# Altium project DuAn_HMI_F7.PrjPcb
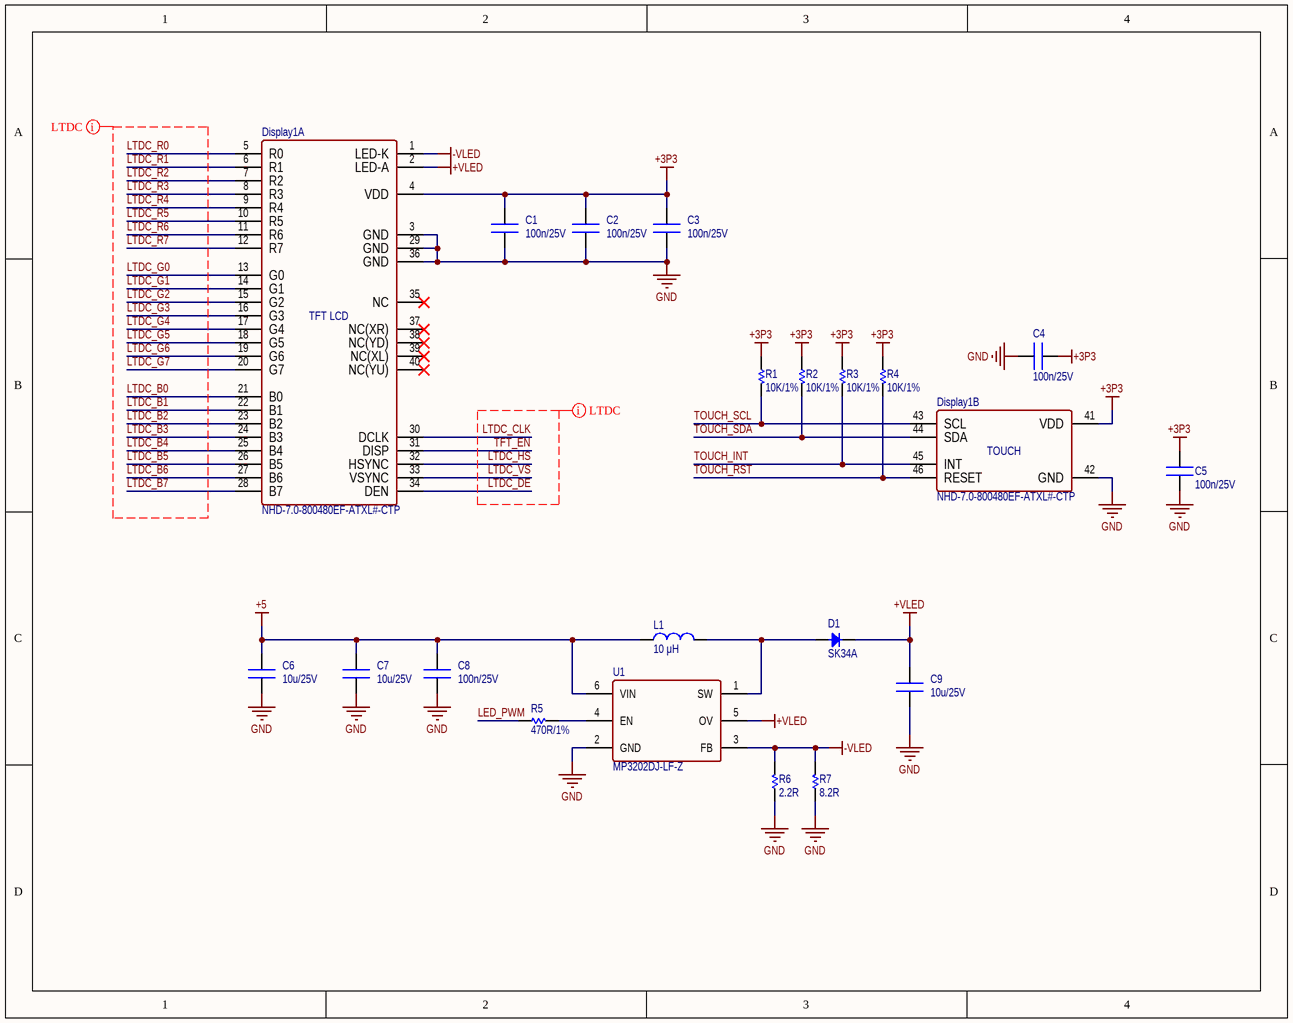
[diagram p0: LCD_TFT.SchDoc]
4 sheets, 65 parts. Net scope: global (net labels, ports and power ports of the same name join across sheets).
Board file: PCB2.PcbDoc
Sheets:
  LCD_TFT.SchDoc
  SDRAM.SchDoc
  MCU.SchDoc
  RS232.SchDoc

## Sheet LCD_TFT.SchDoc
size A; SheetNumber: 1; SheetTotal: 4

### Parts
C1  100n/25V  [CN-SMD-0603]
C2  100n/25V  [CN-SMD-0603]
C3  100n/25V  [CN-SMD-0603]
C4  100n/25V  [CN-SMD-0603]
C5  100n/25V  [CN-SMD-0603]
C6  10u/25V  [CN-SMD-0603]
C7  10u/25V  [CN-SMD-0603]
C8  100n/25V  [CN-SMD-0603]
C9  10u/25V  [CN-SMD-0603]
D1  SK34A  [DIO-SMD-A]
Display1  NHD-7.0-800480EF-ATXL#-CTP  [NHD-7.0-800480EF-ATXL#-CTP]  (parts A,B of 2)
L1  10 μH  [L-SMD-M-5x5]
R1  10K/1%  [RES-SMD-0603]
R2  10K/1%  [RES-SMD-0603]
R3  10K/1%  [RES-SMD-0603]
R4  10K/1%  [RES-SMD-0603]
R5  470R/1%  [RES-SMD-0603]
R6  2.2R  [RES-SMD-0805]
R7  8.2R  [RES-SMD-0805]
U1  MP3202DJ-LF-Z  [SOT23-6]

### Nets
+3P3: C1.2 C2.2 C3.2 C4.2 C5.2 Display1.4(VDD) Display1.41(VDD) R1.1 R2.1 R3.1 R4.1
+5: C6.2 C7.2 C8.2 L1.1 U1.6(VIN)
+VLED: C9.2 D1.2(K) Display1.2(LED-A) U1.5(OV)
-VLED: Display1.1(LED-K) R6.2 R7.2 U1.3(FB)
GND: C1.1 C2.1 C3.1 C4.1 C5.1 C6.1 C7.1 C8.1 C9.1 Display1.3(GND) Display1.29(GND) Display1.36(GND) Display1.42(GND) R6.1 R7.1 U1.2(GND)
LED_PWM: R5.1
LTDC_B0: Display1.21(B0)
LTDC_B1: Display1.22(B1)
LTDC_B2: Display1.23(B2)
LTDC_B3: Display1.24(B3)
LTDC_B4: Display1.25(B4)
LTDC_B5: Display1.26(B5)
LTDC_B6: Display1.27(B6)
LTDC_B7: Display1.28(B7)
LTDC_CLK: Display1.30(DCLK)
LTDC_DE: Display1.34(DEN)
LTDC_G0: Display1.13(G0)
LTDC_G1: Display1.14(G1)
LTDC_G2: Display1.15(G2)
LTDC_G3: Display1.16(G3)
LTDC_G4: Display1.17(G4)
LTDC_G5: Display1.18(G5)
LTDC_G6: Display1.19(G6)
LTDC_G7: Display1.20(G7)
LTDC_HS: Display1.32(HSYNC)
LTDC_R0: Display1.5(R0)
LTDC_R1: Display1.6(R1)
LTDC_R2: Display1.7(R2)
LTDC_R3: Display1.8(R3)
LTDC_R4: Display1.9(R4)
LTDC_R5: Display1.10(R5)
LTDC_R6: Display1.11(R6)
LTDC_R7: Display1.12(R7)
LTDC_VS: Display1.33(VSYNC)
TFT_EN: Display1.31(DISP)
TOUCH_INT: Display1.45(INT) R3.2
TOUCH_RST: Display1.46(RESET) R4.2
TOUCH_SCL: Display1.43(SCL) R1.2
TOUCH_SDA: Display1.44(SDA) R2.2
NetD1_1: D1.1(A) L1.2 U1.1(SW)
NetR5_2: R5.2 U1.4(EN)

Not connected (* = marked no-connect by the designer): Display1 35(NC)* 37(NC(XR))* 38(NC(YD))* 39(NC(XL))* 40(NC(YU))*

### Layout directives
net class LTDC: LTDC_B0, LTDC_B1, LTDC_B2, LTDC_B3, LTDC_B4, LTDC_B5, LTDC_B6, LTDC_B7, LTDC_CLK, LTDC_DE, LTDC_G0, LTDC_G1, LTDC_G2, LTDC_G3, LTDC_G4, LTDC_G5, LTDC_G6, LTDC_G7, LTDC_HS, LTDC_R0, LTDC_R1, LTDC_R2, LTDC_R3, LTDC_R4, LTDC_R5, LTDC_R6, LTDC_R7, LTDC_VS, TFT_EN

### Notes on the sheet
- (in symbol NHD-7.0-800480EF-ATXL#-CTP, part A) TFT LCD
- (in symbol NHD-7.0-800480EF-ATXL#-CTP, part B) TOUCH

### Library data of the parts
C1-C5 C8 = CN: CL10B104KA8NNNC; Value: 33pF
C6 C7 C9 = CN: 0603W106M250XD; Value: 33pF
D1 = Diode SMD: Code - JEDEC: DO-214-AB; Published: 8-Jun-2000; Revision: July-2002: Re-released for DXP Platform.; Publisher: Altium Limited; PN: SK34A
Display1 = NHD-7.0-800480EF-ATXL#-CTP: TFT (Thin-Film-Transistor) Color Liquid Crystal Display Module, 0541044031 + 52271-0679; PN: NHD-7.0-800480EF-ATXL#-CTP
L1 = L-SMD-1: NRS5024T100MMGJ; Manufacturer: Wurth Elektronik; PN: NRS5024T100MMGJ; Inductance: 10 μH; ComponentLink1Description: Manufacturer; ComponentLink1URL: http://www.we-online.de; Created by: Baojun Chen; Created Date: Nov.2015; ComponentLink2Description: Datasheet; ComponentLink2URL: http://katalog.we-online.de/pbs/datasheet/78477010.pdf
R1-R4 = Res-SMD: ERJ-3EKF1002V; Manufacturer: Generic Components; Class: Passive; Published: 08/06/2000; Publisher: Altium Hobart Technology Centre
R5 = Res-SMD: ERJ-1GJF4700C; Manufacturer: Generic Components; Class: Passive; Published: 08/06/2000; Publisher: Altium Hobart Technology Centre
R6 = Res-SMD: RMCF0805JT2R20; Manufacturer: Generic Components; Class: Passive; PN: RMCF0805JT2R20; Publisher: Altium Hobart Technology Centre
R7 = Res-SMD: RMCF0805FT8R20; Manufacturer: Generic Components; Class: Passive; PN: RMCF0805FT8R20; Publisher: Altium Hobart Technology Centre
U1 = MP3202: 1.3A Fixed Frequency White LED Driver; PN: MP3202DJ-LF-Z

## Sheet SDRAM.SchDoc
size A; SheetNumber: 2; SheetTotal: 4
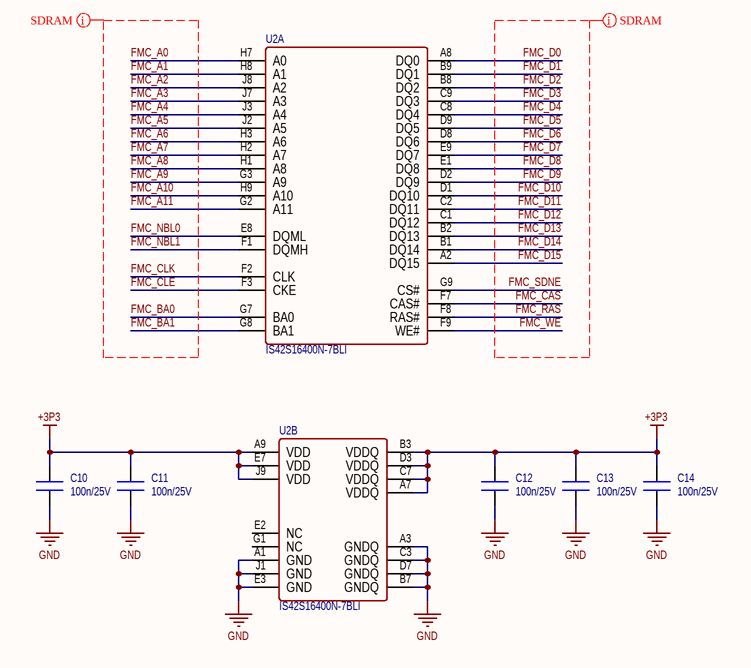
[diagram p1: SDRAM.SchDoc]

### Parts
C10  100n/25V  [CN-SMD-0603]
C11  100n/25V  [CN-SMD-0603]
C12  100n/25V  [CN-SMD-0603]
C13  100n/25V  [CN-SMD-0603]
C14  100n/25V  [CN-SMD-0603]
U2  IS42S16400N-7BLI  [BGA54C80P9X6_800X800X120]  (parts A,B of 2)

### Nets
+3P3: C10.2 C11.2 C12.2 C13.2 C14.2 U2.A7(VDDQ) U2.A9(VDD) U2.B3(VDDQ) U2.C7(VDDQ) U2.D3(VDDQ) U2.E7(VDD) U2.J9(VDD)
GND: C10.1 C11.1 C12.1 C13.1 C14.1 U2.A1(GND) U2.A3(GNDQ) U2.B7(GNDQ) U2.C3(GNDQ) U2.D7(GNDQ) U2.E3(GND) U2.J1(GND)
FMC_A0: U2.H7(A0)
FMC_A1: U2.H8(A1)
FMC_A2: U2.J8(A2)
FMC_A3: U2.J7(A3)
FMC_A4: U2.J3(A4)
FMC_A5: U2.J2(A5)
FMC_A6: U2.H3(A6)
FMC_A7: U2.H2(A7)
FMC_A8: U2.H1(A8)
FMC_A9: U2.G3(A9)
FMC_A10: U2.H9(A10)
FMC_A11: U2.G2(A11)
FMC_BA0: U2.G7(BA0)
FMC_BA1: U2.G8(BA1)
FMC_CAS: U2.F7(CAS#)
FMC_CLE: U2.F3(CKE)
FMC_CLK: U2.F2(CLK)
FMC_D0: U2.A8(DQ0)
FMC_D1: U2.B9(DQ1)
FMC_D2: U2.B8(DQ2)
FMC_D3: U2.C9(DQ3)
FMC_D4: U2.C8(DQ4)
FMC_D5: U2.D9(DQ5)
FMC_D6: U2.D8(DQ6)
FMC_D7: U2.E9(DQ7)
FMC_D8: U2.E1(DQ8)
FMC_D9: U2.D2(DQ9)
FMC_D10: U2.D1(DQ10)
FMC_D11: U2.C2(DQ11)
FMC_D12: U2.C1(DQ12)
FMC_D13: U2.B2(DQ13)
FMC_D14: U2.B1(DQ14)
FMC_D15: U2.A2(DQ15)
FMC_NBL0: U2.E8(DQML)
FMC_NBL1: U2.F1(DQMH)
FMC_RAS: U2.F8(RAS#)
FMC_SDNE: U2.G9(CS#)
FMC_WE: U2.F9(WE#)

Not connected (* = marked no-connect by the designer): U2 E2(NC) G1(NC)

### Layout directives
net class SDRAM: FMC_A0, FMC_A1, FMC_A2, FMC_A3, FMC_A4, FMC_A5, FMC_A6, FMC_A7, FMC_A8, FMC_A9, FMC_A10, FMC_A11, FMC_BA0, FMC_BA1, FMC_CAS, FMC_CLE, FMC_CLK, FMC_D0, FMC_D1, FMC_D2, FMC_D3, FMC_D4, FMC_D5, FMC_D6, FMC_D7, FMC_D8, FMC_D9, FMC_D10, FMC_D11, FMC_D12, FMC_D13, FMC_D14, FMC_D15, FMC_NBL0, FMC_NBL1, FMC_RAS, FMC_SDNE, FMC_WE

### Library data of the parts
C10-C14 = CN: CL10B104KA8NNNC; Value: 33pF
U2 = IS42S16400N-7BLI: 1 Meg Bits x 16 Bits x 4 Banks (64-MBIT) SYNCHRONOUS DYNAMIC RAM; PN: IS42S16400N-7BLI

## Sheet MCU.SchDoc
size C; SheetNumber: 3; SheetTotal: 4
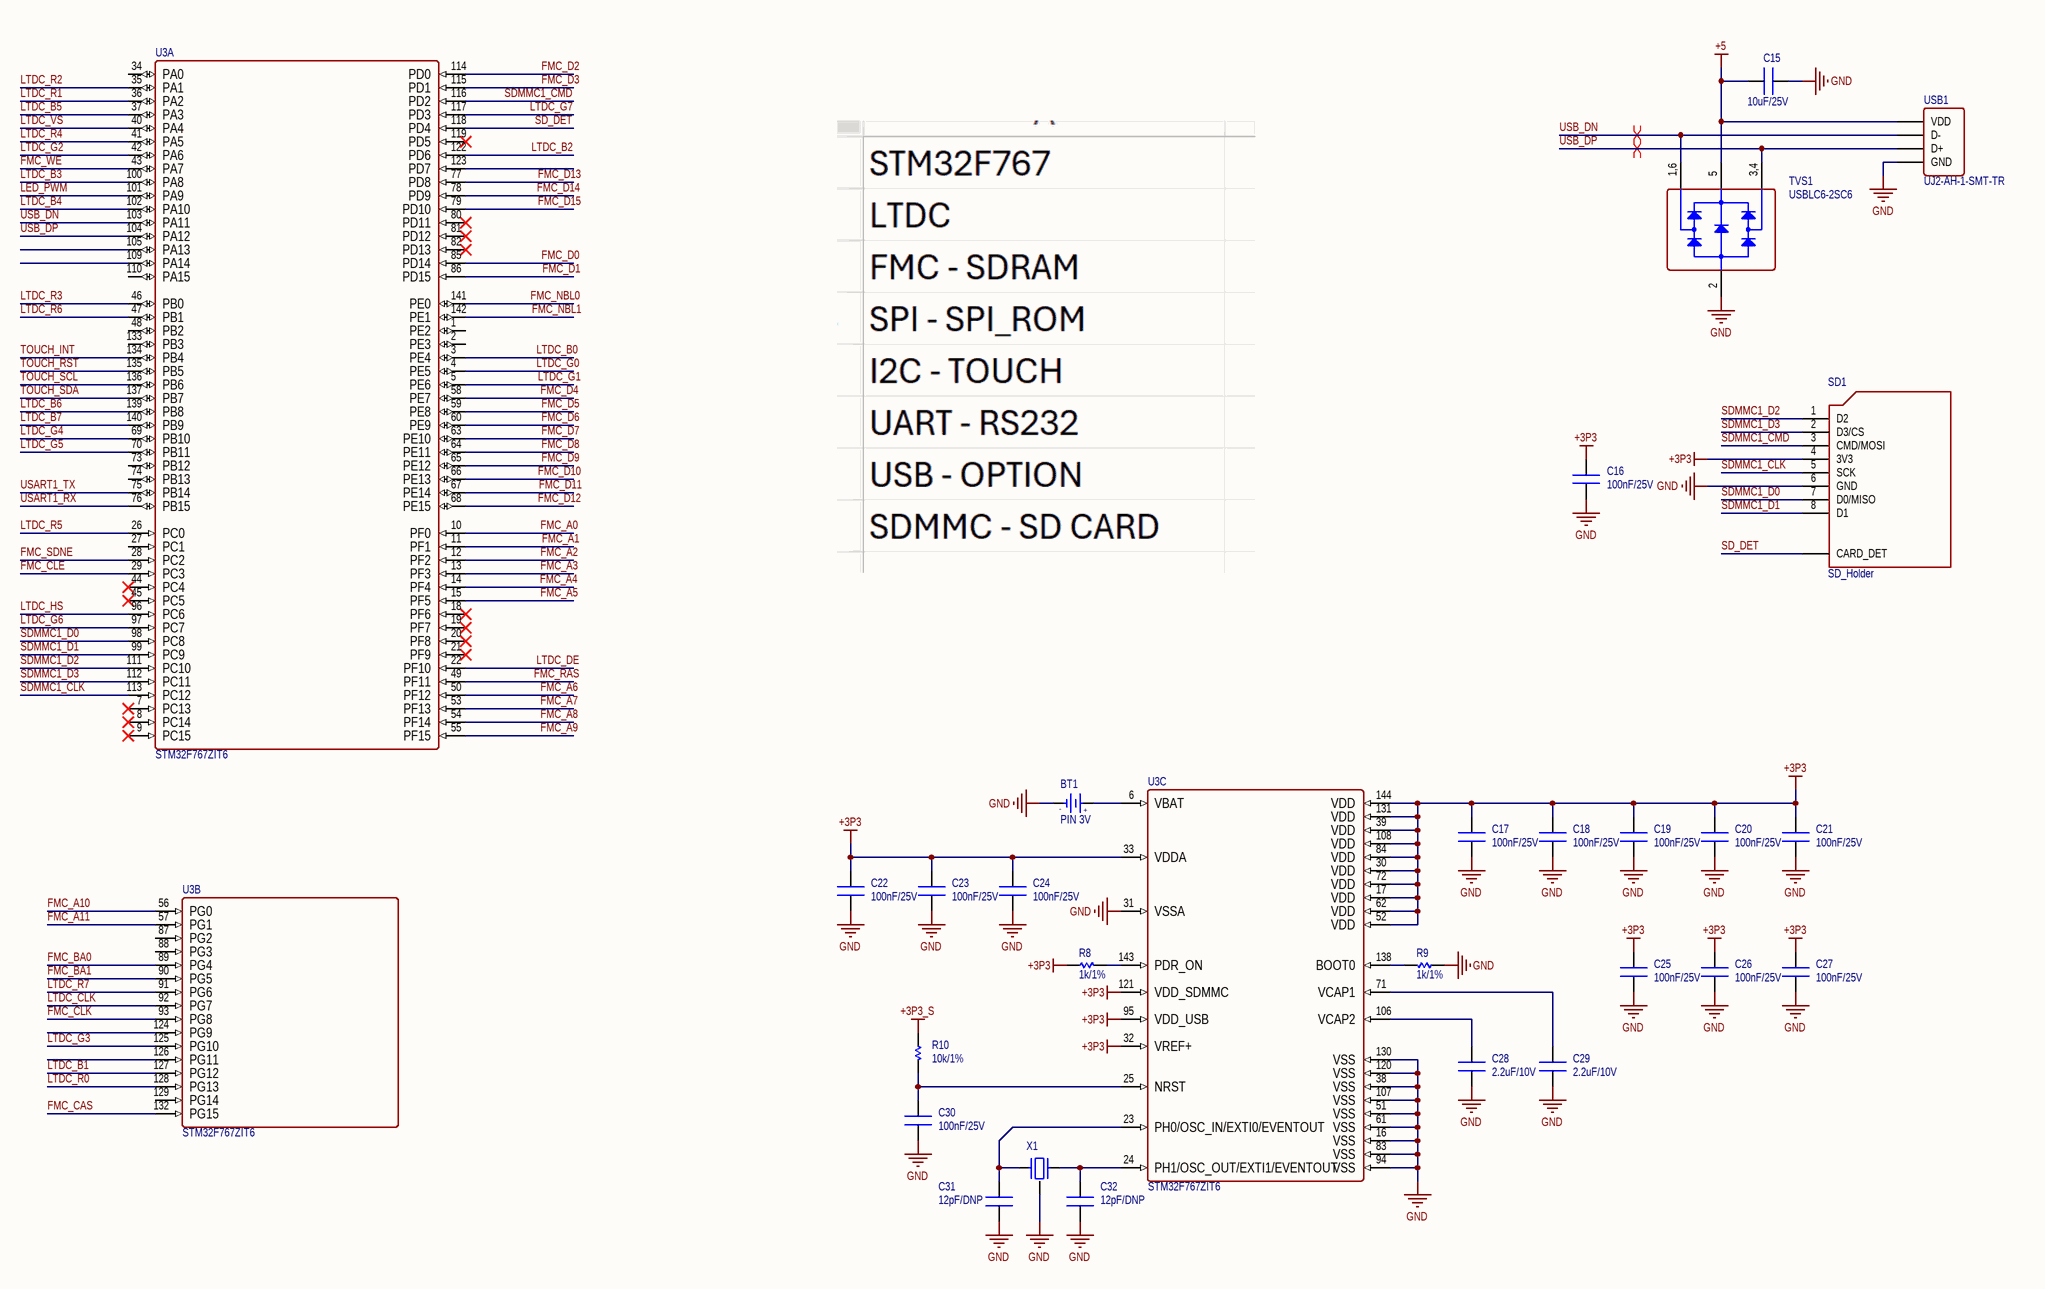
[diagram p2: MCU.SchDoc]

### Parts
BT1  PIN 3V  [PIN CR1220-SMD]
C15  10uF/25V  [CN-SMD-0603]
C16  100nF/25V  [CN-SMD-0603]
C17  100nF/25V  [CN-SMD-0603]
C18  100nF/25V  [CN-SMD-0603]
C19  100nF/25V  [CN-SMD-0603]
C20  100nF/25V  [CN-SMD-0603]
C21  100nF/25V  [CN-SMD-0603]
C22  100nF/25V  [CN-SMD-0603]
C23  100nF/25V  [CN-SMD-0603]
C24  100nF/25V  [CN-SMD-0603]
C25  100nF/25V  [CN-SMD-0603]
C26  100nF/25V  [CN-SMD-0603]
C27  100nF/25V  [CN-SMD-0603]
C28  2.2uF/10V  [CN-SMD-0603]
C29  2.2uF/10V  [CN-SMD-0603]
C30  100nF/25V  [CN-SMD-0603]
C31  12pF/DNP  [CN-SMD-0603]
C32  12pF/DNP  [CN-SMD-0603]
R8  1k/1%  [RES-SMD-0603]
R9  1k/1%  [RES-SMD-0603]
R10  10k/1%  [RES-SMD-0603]
SD1  SD_Holder  [SD Socket]
TVS1  USBLC6-2SC6  [SOT23-6]
U3  STM32F767ZIT6  [LQFP144]  (parts A,B,C of 3)
USB1  UJ2-AH-1-SMT-TR  [USB-C4]
X1  TSX-3225 25.0000MF10P-C0  [XT4-16.000MHz-4_V]  (value not drawn)

### Nets
+3P3: C16.2 C17.2 C18.2 C19.2 C20.2 C21.2 C22.2 C23.2 C24.2 C25.2 C26.2 C27.2 R8.2 SD1.4(3V3) U3.17(VDD) U3.30(VDD) U3.32(VREF+) U3.33(VDDA) U3.39(VDD) U3.52(VDD) U3.62(VDD) U3.72(VDD) U3.84(VDD) U3.95(VDD_USB) U3.108(VDD) U3.121(VDD_SDMMC) U3.131(VDD) U3.144(VDD)
+3P3_S: R10.2
+5: C15.2 TVS1.5 USB1.1(VDD)
GND: BT1.2(GND) C15.1 C16.1 C17.1 C18.1 C19.1 C20.1 C21.1 C22.1 C23.1 C24.1 C25.1 C26.1 C27.1 C28.2 C29.2 C30.2 C31.1 C32.1 R9.2 SD1.6(GND) TVS1.2 U3.16(VSS) U3.31(VSSA) U3.38(VSS) U3.51(VSS) U3.61(VSS) U3.83(VSS) U3.94(VSS) U3.107(VSS) U3.120(VSS) U3.130(VSS) USB1.4(GND) X1.2,4(GND)
FMC_A0: U3.10(PF0)
FMC_A1: U3.11(PF1)
FMC_A2: U3.12(PF2)
FMC_A3: U3.13(PF3)
FMC_A4: U3.14(PF4)
FMC_A5: U3.15(PF5)
FMC_A6: U3.50(PF12)
FMC_A7: U3.53(PF13)
FMC_A8: U3.54(PF14)
FMC_A9: U3.55(PF15)
FMC_A10: U3.56(PG0)
FMC_A11: U3.57(PG1)
FMC_BA0: U3.89(PG4)
FMC_BA1: U3.90(PG5)
FMC_CAS: U3.132(PG15)
FMC_CLE: U3.29(PC3)
FMC_CLK: U3.93(PG8)
FMC_D0: U3.85(PD14)
FMC_D1: U3.86(PD15)
FMC_D2: U3.114(PD0)
FMC_D3: U3.115(PD1)
FMC_D4: U3.58(PE7)
FMC_D5: U3.59(PE8)
FMC_D6: U3.60(PE9)
FMC_D7: U3.63(PE10)
FMC_D8: U3.64(PE11)
FMC_D9: U3.65(PE12)
FMC_D10: U3.66(PE13)
FMC_D11: U3.67(PE14)
FMC_D12: U3.68(PE15)
FMC_D13: U3.77(PD8)
FMC_D14: U3.78(PD9)
FMC_D15: U3.79(PD10)
FMC_NBL0: U3.141(PE0)
FMC_NBL1: U3.142(PE1)
FMC_RAS: U3.49(PF11)
FMC_SDNE: U3.28(PC2)
FMC_WE: U3.43(PA7)
LED_PWM: U3.101(PA9)
LTDC_B0: U3.3(PE4)
LTDC_B1: U3.127(PG12)
LTDC_B2: U3.122(PD6)
LTDC_B3: U3.100(PA8)
LTDC_B4: U3.102(PA10)
LTDC_B5: U3.37(PA3)
LTDC_B6: U3.139(PB8)
LTDC_B7: U3.140(PB9)
LTDC_CLK: U3.92(PG7)
LTDC_DE: U3.22(PF10)
LTDC_G0: U3.4(PE5)
LTDC_G1: U3.5(PE6)
LTDC_G2: U3.42(PA6)
LTDC_G3: U3.125(PG10)
LTDC_G4: U3.69(PB10)
LTDC_G5: U3.70(PB11)
LTDC_G6: U3.97(PC7)
LTDC_G7: U3.117(PD3)
LTDC_HS: U3.96(PC6)
LTDC_R0: U3.128(PG13)
LTDC_R1: U3.36(PA2)
LTDC_R2: U3.35(PA1)
LTDC_R3: U3.46(PB0)
LTDC_R4: U3.41(PA5)
LTDC_R5: U3.26(PC0)
LTDC_R6: U3.47(PB1)
LTDC_R7: U3.91(PG6)
LTDC_VS: U3.40(PA4)
SD_DET: SD1.9(CARD_DET) U3.118(PD4)
SDMMC1_CLK: SD1.5(SCK) U3.113(PC12)
SDMMC1_CMD: SD1.3(CMD/MOSI) U3.116(PD2)
SDMMC1_D0: SD1.7(D0/MISO) U3.98(PC8)
SDMMC1_D1: SD1.8(D1) U3.99(PC9)
SDMMC1_D2: SD1.1(D2) U3.111(PC10)
SDMMC1_D3: SD1.2(D3/CS) U3.112(PC11)
TOUCH_INT: U3.134(PB4)
TOUCH_RST: U3.135(PB5)
TOUCH_SCL: U3.136(PB6)
TOUCH_SDA: U3.137(PB7)
USART1_RX: U3.76(PB15)
USART1_TX: U3.75(PB14)
USB_DN: TVS1.1,6(IO1) U3.103(PA11) USB1.2(D-)
USB_DP: TVS1.3,4(IO2) U3.104(PA12) USB1.3(D+)
NetBT1_1: BT1.1(+3V) U3.6(VBAT)
NetC28_1: C28.1 U3.106(VCAP2)
NetC29_1: C29.1 U3.71(VCAP1)
NetC30_1: C30.1 R10.1 U3.25(NRST)
NetC31_2: C31.2 U3.23(PH0/OSC_IN/EXTI0/EVENTOUT) X1.1
NetC32_2: C32.2 U3.24(PH1/OSC_OUT/EXTI1/EVENTOUT) X1.3
NetR8_1: R8.1 U3.143(PDR_ON)
NetR9_1: R9.1 U3.138(BOOT0)

Not connected (* = marked no-connect by the designer): U3 1(PE2) 2(PE3) 7(PC13)* 8(PC14)* 9(PC15)* 18(PF6)* 19(PF7)* 20(PF8)* 21(PF9)* 27(PC1) 34(PA0) 44(PC4)* 45(PC5)* 48(PB2) 73(PB12) 74(PB13) 80(PD11)* 81(PD12)* 82(PD13)* 87(PG2) 88(PG3) 105(PA13) 109(PA14) 110(PA15) 119(PD5)* 123(PD7) 124(PG9) 126(PG11) 129(PG14) 133(PB3)

### Layout directives
differential pair: USB_DN, USB_DP

### Notes on the sheet
- (in symbol PIN 3V) -; +

### Library data of the parts
BT1 = PIN 3V: 1056; PN: 1056
C15 = CN: 0603W106M250XD; PN: 0603W106M250XD
C16-C27 C30 = CN: CL10B104KA8NNNC; PN: CL10B104KA8NNNC
C28 C29 = CN: CL10B225KP8NNNC; PN: CL10B225KP8NNNC
C31 C32 = CN: CL10C120JB81PNC/DNP; PN: CL10C120JB81PNC/DNP
R8 R9 = Res-SMD: ERJ-3EKF1001V; Manufacturer: Generic Components; Class: Passive; PN: ERJ-3EKF1001V; Publisher: Altium Hobart Technology Centre
R10 = Res-SMD: as R1 on sheet LCD_TFT; PN: ERJ-3EKF1002V; Publisher: Altium Hobart Technology Centre
TVS1 = USBLC6-2: PN: USBLC6-2SC6
U3 = STM32F767ZIT6: High-performance MCU based on Cortex-M7 core with DSP and double-precision FPU, up to 216 MHz CPU, up to 2 MB Flash, ART Accelerator and L1 cache for zero-wait execution.; PN: STM32F767ZIT6
USB1 = USB-4: Manufacturer: Würth Elektronik eiSos GmbH; PN: UJ2-AH-1-SMT-TR; ComponentLink1Description: Manufacturer; ComponentLink1URL: http://www.we-online.de; Created by: Christin Otto; Created Date: OCT-2014; ComponentLink2Description: Datasheet; ComponentLink2URL: http://www.we-online.de/katalog/media/pdf/8492121.pdf
X1 = XT4: PN: TSX-3225 25.0000MF10P-C0

## Sheet RS232.SchDoc
size A; SheetNumber: 4; SheetTotal: 4
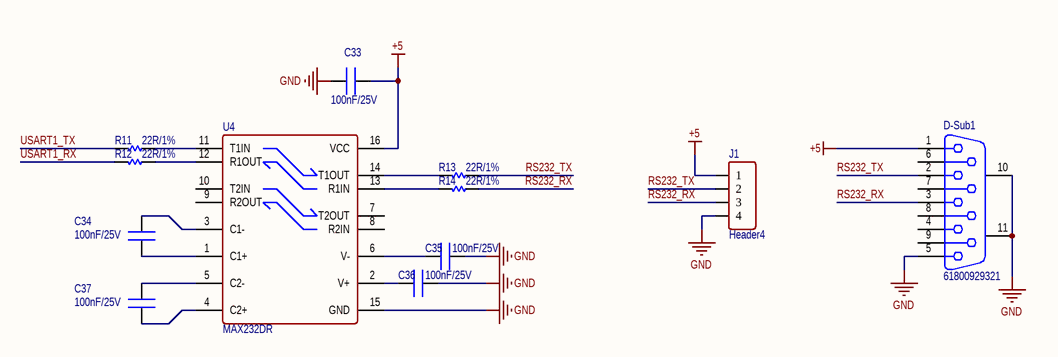
[diagram p3: RS232.SchDoc]

### Parts
C33  100nF/25V  [CN-SMD-0603]
C34  100nF/25V  [CN-SMD-0603]
C35  100nF/25V  [CN-SMD-0603]
C36  100nF/25V  [CN-SMD-0603]
C37  100nF/25V  [CN-SMD-0603]
D-Sub1  61800929321  [COM9E]
J1  Header4  [XH2.54-4-DIP]
R11  22R/1%  [RES-SMD-0603]
R12  22R/1%  [RES-SMD-0603]
R13  22R/1%  [RES-SMD-0603]
R14  22R/1%  [RES-SMD-0603]
U4  MAX232DR  [SO16]

### Nets
+5: C33.1 D-Sub1.1 J1.1 U4.16(VCC)
GND: C33.2 C35.1 C36.1 D-Sub1.5 D-Sub1.10(MH1) D-Sub1.11(MH2) J1.4 U4.15(GND)
RS232_RX: D-Sub1.3 J1.3 R14.1
RS232_TX: D-Sub1.2 J1.2 R13.1
USART1_RX: R12.2
USART1_TX: R11.2
NetC34_1: C34.1 U4.1(C1+)
NetC34_2: C34.2 U4.3(C1-)
NetC35_2: C35.2 U4.6(V-)
NetC36_2: C36.2 U4.2(V+)
NetC37_1: C37.1 U4.4(C2+)
NetC37_2: C37.2 U4.5(C2-)
NetR11_1: R11.1 U4.11(T1IN)
NetR12_1: R12.1 U4.12(R1OUT)
NetR13_2: R13.2 U4.14(T1OUT)
NetR14_2: R14.2 U4.13(R1IN)

Not connected (* = marked no-connect by the designer): D-Sub1 4 6 7 8 9; U4 7(T2OUT) 8(R2IN) 9(R2OUT) 10(T2IN)

### Library data of the parts
C33-C37 = CN: CL10B104KA8NNNC; PN: CL10B104KA8NNNC
D-Sub1 = CON 9BD: Manufacturer: Würth Elektronik eiSos GmbH; PN: 61800929321; ComponentLink1Description: Manufacturer; ComponentLink1URL: http://www.we-online.de; Created by: Christin Zierenner; Created Date: May 2012; ComponentLink2Description: Datasheet; ComponentLink2URL: http://katalog.we-online.de/kataloge/eisos/index.php?language=en&pf=Filter_gerade
J1 = Header4: Connector 4; Manufacturer: W¨¹rth Elektronik eiSos GmbH; partNo: 613002143121; ComponentLink1 Description: Manufacturer; ComponentLink2 Description: Datasheet; NoPins: 02; Created Date: 29 March 2013; ComponentLink1URL: http://www.we-online.com; ComponentLink2URL: http://katalog.we-online.de/em/datasheet/6130xx143121.pdf; Created by: Karrer Zheng
R11-R14 = Res-SMD: ERJ-3EKF22R0V; PN: ERJ-3EKF22R0V
U4 = MAX3232: PN: MAX232DR

## Nets that join several sheets
+3P3: LCD_TFT (11 pins), SDRAM (12 pins), MCU (28 pins)
+5: LCD_TFT (5 pins), MCU (C15.2 TVS1.5 USB1.1), RS232 (C33.1 D-Sub1.1 J1.1 U4.16)
GND: LCD_TFT (16 pins), SDRAM (12 pins), MCU (34 pins), RS232 (8 pins)
FMC_A0: SDRAM (U2.H7), MCU (U3.10)
FMC_A1: SDRAM (U2.H8), MCU (U3.11)
FMC_A2: SDRAM (U2.J8), MCU (U3.12)
FMC_A3: SDRAM (U2.J7), MCU (U3.13)
FMC_A4: SDRAM (U2.J3), MCU (U3.14)
FMC_A5: SDRAM (U2.J2), MCU (U3.15)
FMC_A6: SDRAM (U2.H3), MCU (U3.50)
FMC_A7: SDRAM (U2.H2), MCU (U3.53)
FMC_A8: SDRAM (U2.H1), MCU (U3.54)
FMC_A9: SDRAM (U2.G3), MCU (U3.55)
FMC_A10: SDRAM (U2.H9), MCU (U3.56)
FMC_A11: SDRAM (U2.G2), MCU (U3.57)
FMC_BA0: SDRAM (U2.G7), MCU (U3.89)
FMC_BA1: SDRAM (U2.G8), MCU (U3.90)
FMC_CAS: SDRAM (U2.F7), MCU (U3.132)
FMC_CLE: SDRAM (U2.F3), MCU (U3.29)
FMC_CLK: SDRAM (U2.F2), MCU (U3.93)
FMC_D0: SDRAM (U2.A8), MCU (U3.85)
FMC_D1: SDRAM (U2.B9), MCU (U3.86)
FMC_D2: SDRAM (U2.B8), MCU (U3.114)
FMC_D3: SDRAM (U2.C9), MCU (U3.115)
FMC_D4: SDRAM (U2.C8), MCU (U3.58)
FMC_D5: SDRAM (U2.D9), MCU (U3.59)
FMC_D6: SDRAM (U2.D8), MCU (U3.60)
FMC_D7: SDRAM (U2.E9), MCU (U3.63)
FMC_D8: SDRAM (U2.E1), MCU (U3.64)
FMC_D9: SDRAM (U2.D2), MCU (U3.65)
FMC_D10: SDRAM (U2.D1), MCU (U3.66)
FMC_D11: SDRAM (U2.C2), MCU (U3.67)
FMC_D12: SDRAM (U2.C1), MCU (U3.68)
FMC_D13: SDRAM (U2.B2), MCU (U3.77)
FMC_D14: SDRAM (U2.B1), MCU (U3.78)
FMC_D15: SDRAM (U2.A2), MCU (U3.79)
FMC_NBL0: SDRAM (U2.E8), MCU (U3.141)
FMC_NBL1: SDRAM (U2.F1), MCU (U3.142)
FMC_RAS: SDRAM (U2.F8), MCU (U3.49)
FMC_SDNE: SDRAM (U2.G9), MCU (U3.28)
FMC_WE: SDRAM (U2.F9), MCU (U3.43)
LED_PWM: LCD_TFT (R5.1), MCU (U3.101)
LTDC_B0: LCD_TFT (Display1.21), MCU (U3.3)
LTDC_B1: LCD_TFT (Display1.22), MCU (U3.127)
LTDC_B2: LCD_TFT (Display1.23), MCU (U3.122)
LTDC_B3: LCD_TFT (Display1.24), MCU (U3.100)
LTDC_B4: LCD_TFT (Display1.25), MCU (U3.102)
LTDC_B5: LCD_TFT (Display1.26), MCU (U3.37)
LTDC_B6: LCD_TFT (Display1.27), MCU (U3.139)
LTDC_B7: LCD_TFT (Display1.28), MCU (U3.140)
LTDC_CLK: LCD_TFT (Display1.30), MCU (U3.92)
LTDC_DE: LCD_TFT (Display1.34), MCU (U3.22)
LTDC_G0: LCD_TFT (Display1.13), MCU (U3.4)
LTDC_G1: LCD_TFT (Display1.14), MCU (U3.5)
LTDC_G2: LCD_TFT (Display1.15), MCU (U3.42)
LTDC_G3: LCD_TFT (Display1.16), MCU (U3.125)
LTDC_G4: LCD_TFT (Display1.17), MCU (U3.69)
LTDC_G5: LCD_TFT (Display1.18), MCU (U3.70)
LTDC_G6: LCD_TFT (Display1.19), MCU (U3.97)
LTDC_G7: LCD_TFT (Display1.20), MCU (U3.117)
LTDC_HS: LCD_TFT (Display1.32), MCU (U3.96)
LTDC_R0: LCD_TFT (Display1.5), MCU (U3.128)
LTDC_R1: LCD_TFT (Display1.6), MCU (U3.36)
LTDC_R2: LCD_TFT (Display1.7), MCU (U3.35)
LTDC_R3: LCD_TFT (Display1.8), MCU (U3.46)
LTDC_R4: LCD_TFT (Display1.9), MCU (U3.41)
LTDC_R5: LCD_TFT (Display1.10), MCU (U3.26)
LTDC_R6: LCD_TFT (Display1.11), MCU (U3.47)
LTDC_R7: LCD_TFT (Display1.12), MCU (U3.91)
LTDC_VS: LCD_TFT (Display1.33), MCU (U3.40)
TOUCH_INT: LCD_TFT (Display1.45 R3.2), MCU (U3.134)
TOUCH_RST: LCD_TFT (Display1.46 R4.2), MCU (U3.135)
TOUCH_SCL: LCD_TFT (Display1.43 R1.2), MCU (U3.136)
TOUCH_SDA: LCD_TFT (Display1.44 R2.2), MCU (U3.137)
USART1_RX: MCU (U3.76), RS232 (R12.2)
USART1_TX: MCU (U3.75), RS232 (R11.2)